# Altium schematic sheet Breakout.SchDoc
size A
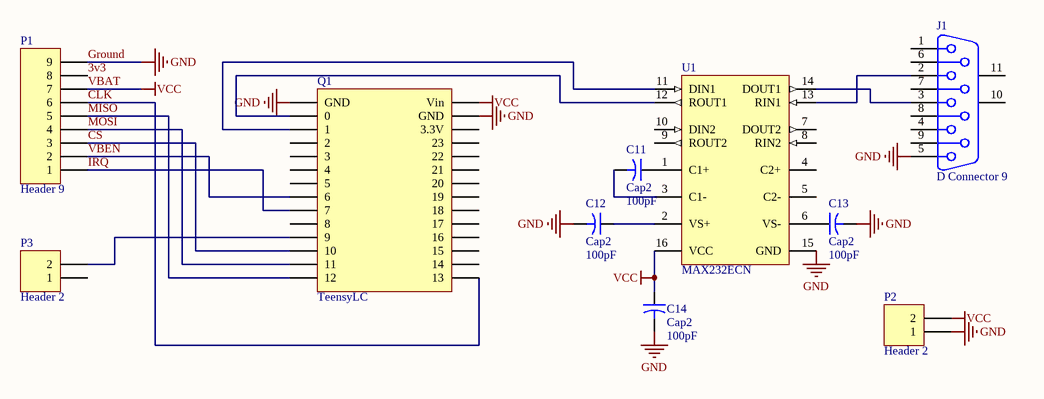
[diagram p0: Breakout.SchDoc]

## Parts
C11  Cap2  value 100pF  [CAPR5-4X5]
C12  Cap2  value 100pF  [CAPR5-4X5]
C13  Cap2  value 100pF  [CAPR5-4X5]
C14  Cap2  value 100pF  [CAPR5-4X5]
J1  D Connector 9  [DSUB1.385-2H9]
P1  Header 9  [HDR1X9]
P2  Header 2  [HDR1X2]
P3  Header 2  [HDR1X2]
Q1  TeensyLC  [TeensyLC]
U1  MAX232ECN  [TI-N16]

## Nets
Ground: C12.2 C13.2 C14.2 J1.5 P1.9 P2.1 Q1.1(GND) Q1.27(GND) U1.15(GND)  [also labelled GND]
VBAT: C14.1 P1.7 P2.2 Q1.28(Vin) U1.16(VCC)  [also labelled VCC]
3v3: P1.8
CLK: P1.6 Q1.15(13)
CS: P1.3 Q1.12(10)
IRQ: P1.1 Q1.9(7)
MISO: P1.5 Q1.14(12)
MOSI: P1.4 Q1.13(11)
VBEN: P1.2 Q1.8(6)
NetC11_1: C11.1 U1.1(C1+)
NetC11_2: C11.2 U1.3(C1-)
NetC12_1: C12.1 U1.2(VS+)
NetC13_1: C13.1 U1.6(VS-)
NetJ1_2: J1.2 U1.13(RIN1)
NetJ1_3: J1.3 U1.14(DOUT1)
NetP3_2: P3.2 Q1.11(9)
NetQ1_2: Q1.2(0) U1.12(ROUT1)
NetQ1_3: Q1.3(1) U1.11(DIN1)

Not connected (* = marked no-connect by the designer): J1 1 4 6 7 8 9 10(MH1) 11(MH2); P3 1; Q1 4(2) 5(3) 6(4) 7(5) 10(8) 16(14) 17(15) 18(16) 19(17) 20(18) 21(19) 22(20) 23(21) 24(22) 25(23) 26(3.3V); U1 4(C2+) 5(C2-) 7(DOUT2) 8(RIN2) 9(ROUT2) 10(DIN2)

## Library data of the parts
C11-C14 = Cap2: Capacitor; Published: 23-Sep-2002; PackageReference: CAPR5-4X5; Publisher: Altium Limited; PackageDescription: Capacitor; 2 Leads
J1 = D Connector 9: Receptacle Assembly, 9 Position, Right Angle; PackageDocument: O; Positions: 9; Published: 15-Jun-2001; LatestRevisionDate: 17-Jul-2002; LatestRevisionNote: Re-released for DXP Platform.; DatasheetDocument: 1-Sep-1999; PackageReference: 788750; Publisher: Altium Limited; Orientation: Right Angle; Gender: Receptacle
P1 = Header 9: Header, 9-Pin; LatestRevisionDate: 17-Jul-2002; LatestRevisionNote: Re-released for DXP Platform.; Publisher: Altium Limited
P2 P3 = Header 2: Header, 2-Pin; LatestRevisionDate: 17-Jul-2002; LatestRevisionNote: Re-released for DXP Platform.; Publisher: Altium Limited
U1 = MAX232ECN: Dual RS-232 Driver / Receiver with IEC61000-4-2 Protection, 0 to 70 degC, 16-Pin PDIP (N),  Pb-Free (RoHS); Drivers Per Package: 2; Supply Voltage(s)(V): 5; ESD HBM(kV): +/-15; ICC(Max)(mA): 10; Single Supply: TRUE; DatasheetVersion: SLLS723B; PackageVersion: revE, Dec-2002; PackageReference: N16; PackageDescription: 16-Pin Plastic Dual-In-Line Package, Row Spacing 7.62 mm, Pitch 2.54 mm; SubFamily: RS-232; Receivers Per Package: 2; RS-232: TRUE; IEC-61000-4-2 SUPPORT: TRUE; ComponentLink1Description: Manufacturer URL; ComponentLink1URL: www.ti.com; ComponentLink2Description: Datasheet; ComponentLink2URL: http://www.ti.com/general/docs/lit/getliterature.tsp?genericPartNumber=MAX232E&fileType=pdf; ComponentLink3Description: Package Specification; ComponentLink3URL: http://www.ti.com/litv/pdf/mpdi002c